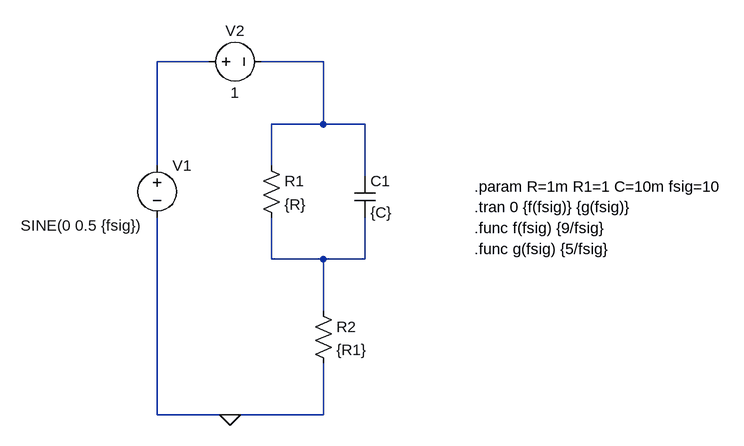
[diagram p0: schematic Draft3.asc]
Draft3.asc, the LTspice schematic file:
Version 4
SHEET 1 972 680
WIRE 112 -64 32 -64
WIRE 288 -64 192 -64
WIRE 288 32 288 -64
WIRE 288 32 208 32
WIRE 352 32 288 32
WIRE 32 96 32 -64
WIRE 208 96 208 32
WIRE 352 112 352 32
WIRE 208 240 208 176
WIRE 288 240 208 240
WIRE 352 240 352 176
WIRE 352 240 288 240
WIRE 288 320 288 240
WIRE 32 480 32 176
WIRE 144 480 32 480
WIRE 288 480 288 400
WIRE 288 480 144 480
FLAG 144 480 0
SYMBOL res 192 80 R0
SYMATTR InstName R1
SYMATTR Value {R}
SYMBOL voltage 32 80 R0
WINDOW 3 -210 108 Left 2
WINDOW 123 0 0 Left 0
WINDOW 39 0 0 Left 0
SYMATTR InstName V1
SYMATTR Value SINE(0 0.5 {fsig})
SYMBOL cap 336 112 R0
SYMATTR InstName C1
SYMATTR Value {C}
SYMBOL res 272 304 R0
SYMATTR InstName R2
SYMATTR Value {R1}
SYMBOL voltage 96 -64 R270
WINDOW 0 32 56 VTop 2
WINDOW 3 -32 56 VBottom 2
WINDOW 123 0 0 Left 0
WINDOW 39 0 0 Left 0
SYMATTR InstName V2
SYMATTR Value 1
TEXT 520 128 Left 2 !.param R=1m R1=1 C=10m fsig=10
TEXT 520 160 Left 2 !.tran 0 {f(fsig)} {g(fsig)}
TEXT 520 192 Left 2 !.func f(fsig) {9/fsig}
TEXT 520 224 Left 2 !.func g(fsig) {5/fsig}

The netlist it stands for:
* Draft3.asc
R1 N002 N003 {R}
V1 N001 0 SINE(0 0.5 {fsig})
C1 N002 N003 {C}
R2 N003 0 {R1}
V2 N001 N002 1
.param R=1m R1=1 C=10m fsig=10
.tran 0 {f(fsig)} {g(fsig)}
.func f(fsig) {9/fsig}
.func g(fsig) {5/fsig}
.backanno
.end